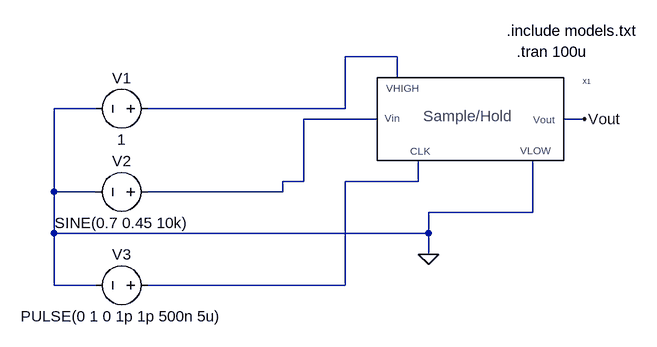
[diagram p0: schematic sample_hold_test.asc]
sample_hold_test.asc, the LTspice schematic file:
Version 4
SHEET 1 880 680
WIRE 176 -32 96 -32
WIRE 176 0 176 -32
WIRE -288 48 -352 48
WIRE 96 48 96 -32
WIRE 96 48 -208 48
WIRE 144 64 32 64
WIRE 464 64 432 64
WIRE 32 160 32 64
WIRE 32 160 0 160
WIRE 208 160 208 128
WIRE 208 160 96 160
WIRE -352 176 -352 48
WIRE -288 176 -352 176
WIRE 0 176 0 160
WIRE 0 176 -208 176
WIRE 384 208 384 128
WIRE 384 208 224 208
WIRE -352 240 -352 176
WIRE 224 240 224 208
WIRE 224 240 -352 240
WIRE 224 272 224 240
WIRE -352 320 -352 240
WIRE -288 320 -352 320
WIRE 96 320 96 160
WIRE 96 320 -208 320
FLAG 224 272 0
FLAG 464 64 Vout
SYMBOL voltage -192 48 R90
WINDOW 0 -32 56 VBottom 2
WINDOW 3 32 56 VTop 2
WINDOW 123 0 0 Left 0
WINDOW 39 0 0 Left 0
SYMATTR InstName V1
SYMATTR Value 1
SYMBOL voltage -192 176 R90
WINDOW 0 -32 56 VBottom 2
WINDOW 3 32 56 VTop 2
WINDOW 123 0 0 Left 0
WINDOW 39 0 0 Left 0
SYMATTR InstName V2
SYMATTR Value SINE(0.7 0.45 10k)
SYMBOL voltage -192 320 R90
WINDOW 0 -32 56 VBottom 2
WINDOW 3 32 56 VTop 2
WINDOW 123 0 0 Left 0
WINDOW 39 0 0 Left 0
SYMATTR InstName V3
SYMATTR Value PULSE(0 1 0 1p 1p 500n 5u)
SYMBOL sample_hold 240 64 R0
SYMATTR InstName X1
TEXT 344 -72 Left 2 !.include models.txt
TEXT 360 -40 Left 2 !.tran 100u

The netlist it stands for:
* sample_hold_test.asc
V1 N001 0 1
V2 N002 0 SINE(0.7 0.45 10k)
V3 N003 0 PULSE(0 1 0 1p 1p 500n 5u)
XX1 N001 0 N003 Vout N002 sample_hold  ; pins VHIGH VLOW clk Vout Sample_IN
.include models.txt
.tran 100u
.backanno
.end